# Altium schematic sheet CAN.SchDoc
size A4; SheetNumber: 4; SheetTotal: 6
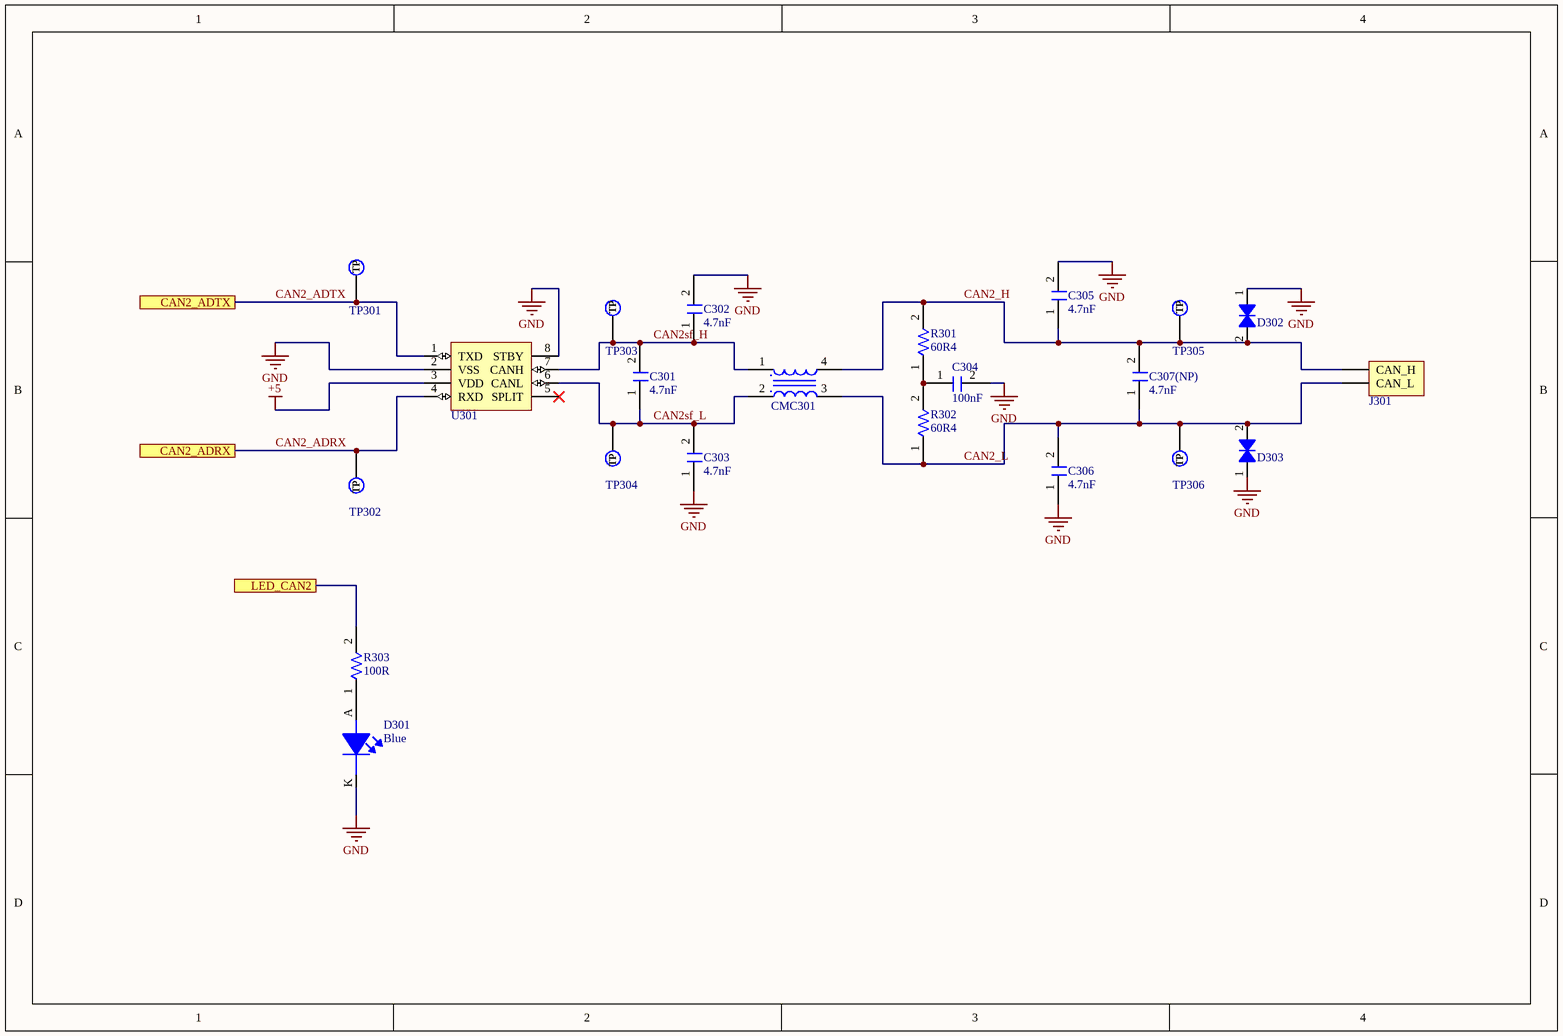
[diagram p0: CAN.SchDoc]

## Parts
C301  Capacitance: 4.7nF  [C1206FNPC-RW]  (hidden comment: 885012208025)
C302  Capacitance: 4.7nF  [C1206FNPC-RW]  (hidden comment: 885012208025)
C303  Capacitance: 4.7nF  [C1206FNPC-RW]  (hidden comment: 885012208025)
C304  Capacitance: 100nF  [C1206FNPC-RW]  (hidden comment: 885012208009)
C305  Capacitance: 4.7nF  [C1206FNPC-RW]  (hidden comment: 885012208025)
C306  Capacitance: 4.7nF  [C1206FNPC-RW]  (hidden comment: 885012208025)
C307(NP)  Capacitance: 4.7nF  [C1206FNPC-RW]  (hidden comment: 885012208025)
CMC301  744226  [CMC_10u_1.6A]  (value not drawn)
D301  Color: Blue  [LED_1206_WE]  (hidden comment: 150120BS75000)
D302  824501600  [DTVS-DO-214AC]  (value not drawn)
D303  824501600  [DTVS-DO-214AC]  (value not drawn)
J301  430450200  [J_CAN]  (value not drawn)
R301  value 60R4  [R1206FTK-W]  (hidden comment: RQ73C2B60R4BTDF)
R302  value 60R4  [R1206FTK-W]  (hidden comment: RQ73C2B60R4BTDF)
R303  Resistance: 100R  [R1206FTK-W]  (hidden comment: CRG1206F100R)
TP301  TestPoint  [TestPoint]  (value not drawn)  (no BOM)
TP302  TestPoint  [TestPoint]  (value not drawn)  (no BOM)
TP303  TestPoint  [TestPoint]  (value not drawn)  (no BOM)
TP304  TestPoint  [TestPoint]  (value not drawn)  (no BOM)
TP305  TestPoint  [TestPoint]  (value not drawn)  (no BOM)
TP306  TestPoint  [TestPoint]  (value not drawn)  (no BOM)
U301  MCP2561-H/SN  [Transceiver_CAN]  (value not drawn)

## Ports
CAN2_ADRX, CAN2_ADTX, LED_CAN2

## Nets
+5: U301.3(VDD)
GND: C302.2 C303.1 C304.2 C305.2 C306.1 D301.K D302.1 D303.1 U301.2(VSS) U301.8(STBY)
CAN2_ADRX: TP302.1(TP) U301.4(RXD) ; port CAN2_ADRX
CAN2_ADTX: TP301.1(TP) U301.1(TXD) ; port CAN2_ADTX
CAN2_H: C305.1 C307(NP).2 CMC301.4(4_OUT) D302.2 J301.1(CAN_H) R301.2 TP305.1(TP)
CAN2_L: C306.2 C307(NP).1 CMC301.3(3_OUT) D303.2 J301.2(CAN_L) R302.1 TP306.1(TP)
CAN2sf_H: C301.2 C302.1 CMC301.1(1_IN) TP303.1(TP) U301.7(CANH)
CAN2sf_L: C301.1 C303.2 CMC301.2(2_IN) TP304.1(TP) U301.6(CANL)
LED_CAN2: R303.2 ; port LED_CAN2
NetC304_1: C304.1 R301.1 R302.2
NetD301_A: D301.A R303.1

Not connected (* = marked no-connect by the designer): U301 5(SPLIT)*

## Library data of the parts
C301-C303 C305 C306 C307(NP) = C4.7n-16V-1206FNPC-X7R: Cap, 4700PF, 16V, 10%, X7R, 1206; Manufacturer: Wurth Electronics; Material: Ceramic; Category: Capacitor; ComponentLink1Description: Datasheet; ComponentLink1URL: https://www.we-online.com/catalog/datasheet/885012208025.pdf; ComponentLink2Description: Where buy it; ComponentLink2URL: https://www.we-online.com/catalog/en/WCAP-CSGP-16VDC#885012208025; Supplier 1: Digi-Key; Manufacturer Part Number: 885012208025; RoHS: Yes; Stock 1: 2013; Pricing 1: 1=0,14000, 10=0,12500, 100=0,11200, 500=0,09900 (USD); Mount: Surface Mount; Case/Package: 1206; Case Code (Metric): 3216; Case Code (Imperial): 1206; Min Operating Temperature: -55°C; Max Operating Temperature: 125°C; Tolerance: 10%; Packaging: Cut Tape; Voltage Rating: 16V; Length: 0.126inch; Width: 0.063inch; Height: 1.6mm; Thickness: 0.035inch; RoHS Compliant: Yes; Supplier Part Number 1: 732-8092-1-ND
C304 = C100n-10V-1206FNPC-X7R: Cap, 0.1ΜF, 10V, 10%, X7R, 1206; Manufacturer 1: Wurth Electronics; Supplier 1: Digi-Key; Manufacturer Part Number 1: 885012208009; RoHS: Yes; Category: Ceramic Capacitors; Stock 1: 7198; Pricing 1: 1=0,11000, 10=0,10300, 100=0,09200, 500=0,08100 (USD); Mount: Surface Mount; Case/Package: 1206; Case Code (Metric): 3216; Case Code (Imperial): 1206; Min Operating Temperature: -55°C; Max Operating Temperature: 125°C; Packaging: Tape and Reel; Voltage Rating: 10V; Tolerance: 10%; Length: 0.126inch; Width: 0.063inch; Thickness: 0.035inch; RoHS Compliant: Yes; ComponentLink1URL: http://www.farnell.com/datasheets/2031891.pdf?src-supplier=Farnell; ComponentLink1Description: http://www.farnell.com/datasheets/2031891.pdf?src-supplier=Farnell; ComponentLink2URL: http://katalog.we-online.de/pbs/datasheet/885012208009.pdf?src-supplier=Digi-Key; ComponentLink2Description: http://katalog.we-online.de/pbs/datasheet/885012208009.pdf?src-supplier=Digi-Key; ComponentLink3URL: https://katalog.we-online.de/pbs/datasheet/885012208009.pdf?src-supplier=Digi-Key; ComponentLink3Description: https://katalog.we-online.de/pbs/datasheet/885012208009.pdf?src-supplier=Digi-Key; Supplier Part Number 1: 732-8086-1-ND; ComponentLink4Description: Wurth Elektronik; ComponentLink4URL: https://www.we-online.com/catalog/en/WCAP-CSGP-10VDC?sq=885012208009#885012208009
CMC301 = CMC_10u_1.6A: Common Mode Chokes Dual 10uH 920Ohm 1kHz 1.6A 80mOhm DCR SMD T/R; Manufacturer: Wurth Electronics; Core Material: Ferrite; Voltage Rating: 80V; Tolerance: 30%; Impedance: 920R; Resistance: 80mR; Number of Lines: 2; Category: Common Mode Line Filter; ComponentLink1Description: Datasheet; ComponentLink1URL: https://www.we-online.com/catalog/datasheet/744226.pdf; ComponentLink2Description: Where buy it; ComponentLink2URL: https://www.we-online.com/catalog/en/WE-SL2?sq=744226#744226; Supplier 1: Digi-Key; Manufacturer Part Number: 744226; RoHS: Yes; Stock 1: 1943; Pricing 1: 1=2,55000, 10=2,51500, 50=2,27200, 100=2,19100, 500=2,02900 (USD); Mount: Surface Mount; Case/Package: SMD/SMT; Number of Pins: 4; Weight: 0.017672oz; Min Operating Temperature: -40°C; Max Operating Temperature: 125°C; Packaging: Tape and Reel; Package Quantity: 1; Termination: SMD/SMT; Series: WE-SL2; Inductance: 10uH; Voltage Rating (DC): 80V; Current Rating: 1.6A; Max DC Current: 1.6A; DC Resistance (DCR): 80mR; Test Frequency: 1kHz; Current: 1.6A; Inductance Tolerance: 30%; DC Current: 1.6A; Length: 9.2mm; Width: 6mm; Height: 5mm; Depth: 6.3mm; RoHS Compliant: Yes; REACH SVHC: No SVHC; Lead Free: Lead Free; Supplier Part Number 1: 732-1475-1-ND
D301 = LEDBS-1206-145: Led, Blue, 470 Nm, 3.2 V, 30 Ma, 145 Mcd Rohs Compliant: Yes; Manufacturer: Wurth Electronics; Luminous Intensity: 145mcd; Viewing Angle: 140°; Wavelength: 470nm; Forward Current: 30mA; Lens Style: Clear,Rectangular; Test Current: 20mA; Forward Voltage: 3.2V; Supplier 1: RSComponents; Manufacturer Part Number: 150120BS75000; RoHS: Yes; Category: LEDs; Stock 1: 1; Pricing 1: 50=0,23200, 500=0,16400, 750=0,15500, 1500=0,15000, 3000=0,14200 (USD); Mount: Surface Mount; Case/Package: 1206; Case Code (Metric): 3216; Case Code (Imperial): 1206; Min Operating Temperature: -40°C; Max Operating Temperature: 85°C; Package Quantity: 3000; Packaging: Tape and Reel; Dominant Wavelength: 470nm; Length: 3.2mm; Width: 1.6mm; Height: 0.68mm; REACH SVHC: Unknown; RoHS Compliant: Yes; ComponentLink1URL: https://datasheet.ciiva.com/22656/150120bs75000-22656976.pdf?src-supplier=Element14; ComponentLink1Description: https://datasheet.ciiva.com/22656/150120bs75000-22656976.pdf?src-supplier=Element14; ComponentLink2URL: https://datasheet.ciiva.com/29279/759440-da-01-en-chipled-1206-w-kl-blau-150120bs75000-29279045.pdf?src-supplier=Conrad; ComponentLink2Description: https://datasheet.ciiva.com/29279/759440-da-01-en-chipled-1206-w-kl-blau-150120bs75000-29279045.pdf?src-supplier=Conrad; ComponentLink3URL: https://datasheet.ciiva.com/29561/150120bs75000-29561882.pdf?src-supplier=Digi-Key; ComponentLink3Description: https://datasheet.ciiva.com/29561/150120bs75000-29561882.pdf?src-supplier=Digi-Key; Supplier Part Number 1: 8154243; ComponentLink4Description: Where buy it; ComponentLink4URL: https://www.we-online.com/catalog/en/WL-SMCW?sq=150120BS75000#150120BS75000
D302 D303 = DTVS-6V-DO-214AC: TVS diode [Würth Elektronik] 824501600 TVS diode; Manufacturer: Wurth Electronics; Number of Bidirectional Channels: 1; Reverse Standoff Voltage: 6V; Min Breakdown Voltage: 7.02V; Clamping Voltage: 10.3V; Peak Pulse Power: 400W; Power Line Protection: No; Polarity: Bidirectional; Peak Pulse Current: 38.8A; ComponentLink1Description: Where buy it; ComponentLink1URL: https://www.we-online.com/catalog/en/WE-TVSP?sq=824501600#824501600; Supplier 1: Mouser; Manufacturer Part Number: 824501600; RoHS: Yes; Category: TVS Diodes; Stock 1: 780; Pricing 1: 1=0,28000, 10=0,26100, 50=0,26100, 100=0,23400, 500=0,20400, 1000=0,17400, 10000=0,17400 (USD); Mount: Surface Mount; Number of Pins: 2; Min Operating Temperature: -65°C; Max Operating Temperature: 150°C; Packaging: Cut Tape; Max Breakdown Voltage: 7.02V; Resistor Type: Zener; REACH SVHC: Unknown; RoHS Compliant: Yes; ComponentLink2URL: http://www.farnell.com/datasheets/2036401.pdf?src-supplier=Element14; ComponentLink2Description: http://www.farnell.com/datasheets/2036401.pdf?src-supplier=Element14; Supplier Part Number 1: 710-824501600; ComponentLink3URL: https://katalog.we-online.de/pbs/datasheet/824501600.pdf?src-supplier=Digi-Key; ComponentLink3Description: https://katalog.we-online.de/pbs/datasheet/824501600.pdf?src-supplier=Digi-Key
J301 = J_CAN: Header 2 Row Right-Angle Snap-In Lock 2Pin Tin Plate SMT/Glow Wire Compatible; Manufacturer: Molex; Temperature rating: -40° to +105°C; Category type: PCB header; Product name: Micro-Fit; Maximum current: 8.5 A; Maximum voltage: 600 V; Connections: 2x1; Contact Resistance: 10mR; Number of Contacts: 2; Voltage Rating: 600V; Gender: Male; Current Rating: 5A; Voltage Rating (DC): 250V; Insulation Resistance: 1GR; Max Voltage Rating (DC): 250.25kV; Pitch: 3mm; Glow Wire Compliant: Compliant; Approvals: UL,CSA,TUV; Category: Connector; ComponentLink1Description: Datasheet; ComponentLink1URL: https://www.molex.com/pdm_docs/sd/430450200_sd.pdf; ComponentLink2Description: Where buy it; ComponentLink2URL: *; Manufacturer part number: 430450200; Supplier: *; RoHS: Yes; Application: Wire to board; Flammability: 94V-0; Orientation: Right Angle; Mount: Through hole; Supplier 1: Digi-Key; Stock 1: 14652; Pricing 1: 1=1,12000, 10=0,92600, 80=0,77138, 3168=0,55921, 6336=0,53993, 12672=0,50136 (USD); Case/Package: SMC; Contact Plating: Tin; Color: Black; Contact Material: Brass,Tin; Housing Material: Thermoplastic; Housing Color: Black; Material: Thermoplastic; Min Operating Temperature: -40°C; Max Operating Temperature: 105°C; Termination: Through Hole; Number of Rows: 2; Packaging: Tray; Number of Positions: 2; Package Quantity: 3168; Number of Circuits: 2; Contact Gender: Male; Diameter: 3mm; Row Spacing: 3mm; Radiation Hardening: No; Flammability Rating: UL94 V-0; Lead Free: Lead Free; REACH SVHC: Unknown; Halogen Free: Low Halogen; ComponentLink3URL: https://datasheet.ciiva.com/14155/04402310-14155203.pdf?src-supplier=Distrelec; ComponentLink3Description: https://datasheet.ciiva.com/14155/04402310-14155203.pdf?src-supplier=Distrelec; ComponentLink4URL: https://datasheet.ciiva.com/5150/0430450200-pcb-headers-145770-5150407.pdf?src-supplier=Mouser; ComponentLink4Description: https://datasheet.ciiva.com/5150/0430450200-pcb-headers-145770-5150407.pdf?src-supplier=Mouser; ComponentLink5URL: https://datasheet.ciiva.com/19454/883270-19454006.pdf?src-supplier=Jameco; ComponentLink5Description: https://datasheet.ciiva.com/19454/883270-19454006.pdf?src-supplier=Jameco; ComponentLink6URL: https://datasheet.ciiva.com/11747/0900766b80027348-11747001.pdf?src-supplier=RSComponents; ComponentLink6Description: https://datasheet.ciiva.com/11747/0900766b80027348-11747001.pdf?src-supplier=RSComponents; ComponentLink7URL: https://datasheet.ciiva.com/36854/124280430450200-pcb-headers-36854331.pdf?src-supplier=Onlinecomponents.com; ComponentLink7Description: https://datasheet.ciiva.com/36854/124280430450200-pcb-headers-36854331.pdf?src-supplier=Onlinecomponents.com; ComponentLink8URL: https://datasheet.ciiva.com/16656/0430450200-pcb-headers-16656330.pdf?src-supplier=Avnet+Europe; ComponentLink8Description: https://datasheet.ciiva.com/16656/0430450200-pcb-headers-16656330.pdf?src-supplier=Avnet+Europe; ComponentLink9URL: https://datasheet.ciiva.com/10090/0430450200-pcb-headers-10090299.pdf?src-supplier=Avnet; ComponentLink9Description: https://datasheet.ciiva.com/10090/0430450200-pcb-headers-10090299.pdf?src-supplier=Avnet; ComponentLink10URL: https://datasheet.ciiva.com/1443/1859921-1443437.pdf?src-supplier=Element14; ComponentLink10Description: https://datasheet.ciiva.com/1443/1859921-1443437.pdf?src-supplier=Element14; Supplier Part Number 1: WM1813-ND
R301 R302 = R60-1206FTN: Res Precision Thin Film 60.4Ohm 0.1% 400mW 10ppm/°C 2-Pin 1206 SMD T/R; Manufacturer: TE Connectivity Holsworthy; Category: Resistor; ComponentLink1Description: Datasheet; ComponentLink1URL: https://docs.rs-online.com/7017/0900766b8171e31c.pdf; ComponentLink2Description: Where buy it; ComponentLink2URL: https://es.rs-online.com/web/p/resistencias-de-montaje-en-superficie/1873086; Supplier 1: RSComponents; Manufacturer Part Number: RQ73C2B60R4BTDF; RoHS: Yes; Stock 1: 650; Pricing 1: 1000=1,73300 (GBP); Supplier Part Number 1: 1872611
R303 = R100-1206FTK: Res Thick Film 1206 100 Ohm 1% 0.25W(1/4W) ±200ppm/C Pad SMD T/R; Manufacturer: TE Connectivity; Temperature Coefficient: 200ppm/°C; Max Power Dissipation: 250mW; Voltage Rating: 200V; Number of Resistors: 1; Category: Resistor; ComponentLink1Description: Datasheet; ComponentLink1URL: https://docs.rs-online.com/7aab/0900766b815b7339.pdf; ComponentLink2Description: Where buy it; ComponentLink2URL: https://es.rs-online.com/web/p/resistencias-de-montaje-en-superficie/2232120; Supplier 1: Digi-Key; Manufacturer Part Number: CRG1206F100R; RoHS: Yes; Stock 1: 13476; Pricing 1: 1=0,10000, 10=0,07600, 100=0,02920, 1000=0,01285, 2500=0,01110 (USD); Mount: Surface Mount; Case/Package: 1206; Case Code (Imperial): 1206; Case Code (Metric): 3216; Weight: 0.000571oz; Min Operating Temperature: -55°C; Max Operating Temperature: 125°C; Tolerance: 1%; Resistor Type: Thick Film; Packaging: Tape and Reel; Package Quantity: 5000; Number of Terminations: 2; Series: CRG, Neohm; Power Rating: 250mW; Termination: Solder; Technology: THICK FILM; Length: 3.1mm; Width: 1.55mm; Height: 0.55mm; Depth: 1.55mm; Radiation Hardening: No; RoHS Compliant: Yes; ELV: Compliant; ComponentLink3URL: https://datasheet.ciiva.com/11808/0900766b800a696e-11808648.pdf?src-supplier=RSComponents; ComponentLink3Description: https://datasheet.ciiva.com/11808/0900766b800a696e-11808648.pdf?src-supplier=RSComponents; ComponentLink4URL: https://datasheet.ciiva.com/16763/70063020-16763547.pdf?src-supplier=Allied+Electronics; ComponentLink4Description: https://datasheet.ciiva.com/16763/70063020-16763547.pdf?src-supplier=Allied+Electronics; ComponentLink5URL: https://datasheet.ciiva.com/5562/eng-ds-1773204-g-5562604.pdf?src-supplier=Mouser; ComponentLink5Description: https://datasheet.ciiva.com/5562/eng-ds-1773204-g-5562604.pdf?src-supplier=Mouser; Supplier Part Number 1: A106068CT-ND
TP301-TP306 = TestPoint: Test Point 1x1 mm; Category: TestPoint
U301 = Transceiver_CAN: CAN Transceiver, 4.5 to 5.5V, 70mA, -40 to 150C, SOIC-8, RoHS; Manufacturer: Digi-Key; Manufacturer part: Microchip; Min Supply Voltage: 4.5V; Data Rate: 1Mbps; Operating Supply Voltage: 5V; Nominal Supply Current: 75mA; Number of Transceivers: 1; Slew Rate: 8.5V/µs; Propagation Delay: 125ns; RoHS: Yes; Mount: SMD; Case/Package: SOIC; Number of Pins: 8; Min Operating Temperature: -40°C; Max Operating Temperature: 85°C; Max Supply Voltage: 5.5V; Packaging: Rail/Tube; Interface: CAN; Number of Transmit Buffers: 1; Number of Receive Buffers: 1; Max Supply Current: 75mA; Number of Drivers: 1; Number of Receivers: 1; REACH SVHC: No SVHC; ComponentLink1URL: https://pdf1.alldatasheet.com/datasheet-pdf/view/514790/MICROCHIP/MCP2561.html; ComponentLink1Description: Datasheet; Category: Transceiver CAN; ComponentLink2Description: Where buy it; ComponentLink2URL: *; Supplier 1: Digi-Key; Manufacturer Part Number: MCP2561-H/SN; Pricing 1: 1=1,17000, 25=0,96480, 100=0,90000 (USD); Package Quantity: 100; Turn-On Delay Time: 125ns; Radiation Hardening: No; RoHS Compliant: Yes; ComponentLink3URL: https://datasheet.ciiva.com/18624/25167b-18624813.pdf?src-supplier=Digi-Key; ComponentLink3Description: https://datasheet.ciiva.com/18624/25167b-18624813.pdf?src-supplier=Digi-Key; Supplier Part Number 1: MCP2561-H/SN-ND